# Altium schematic sheet OPAMP_TESTER.SchDoc: OPAMP_TESTER
size A4; CheckedBy: D.MOHAMMADI; DrawnBy: A.RAJABI; SheetNumber: 1; SheetTotal: 4
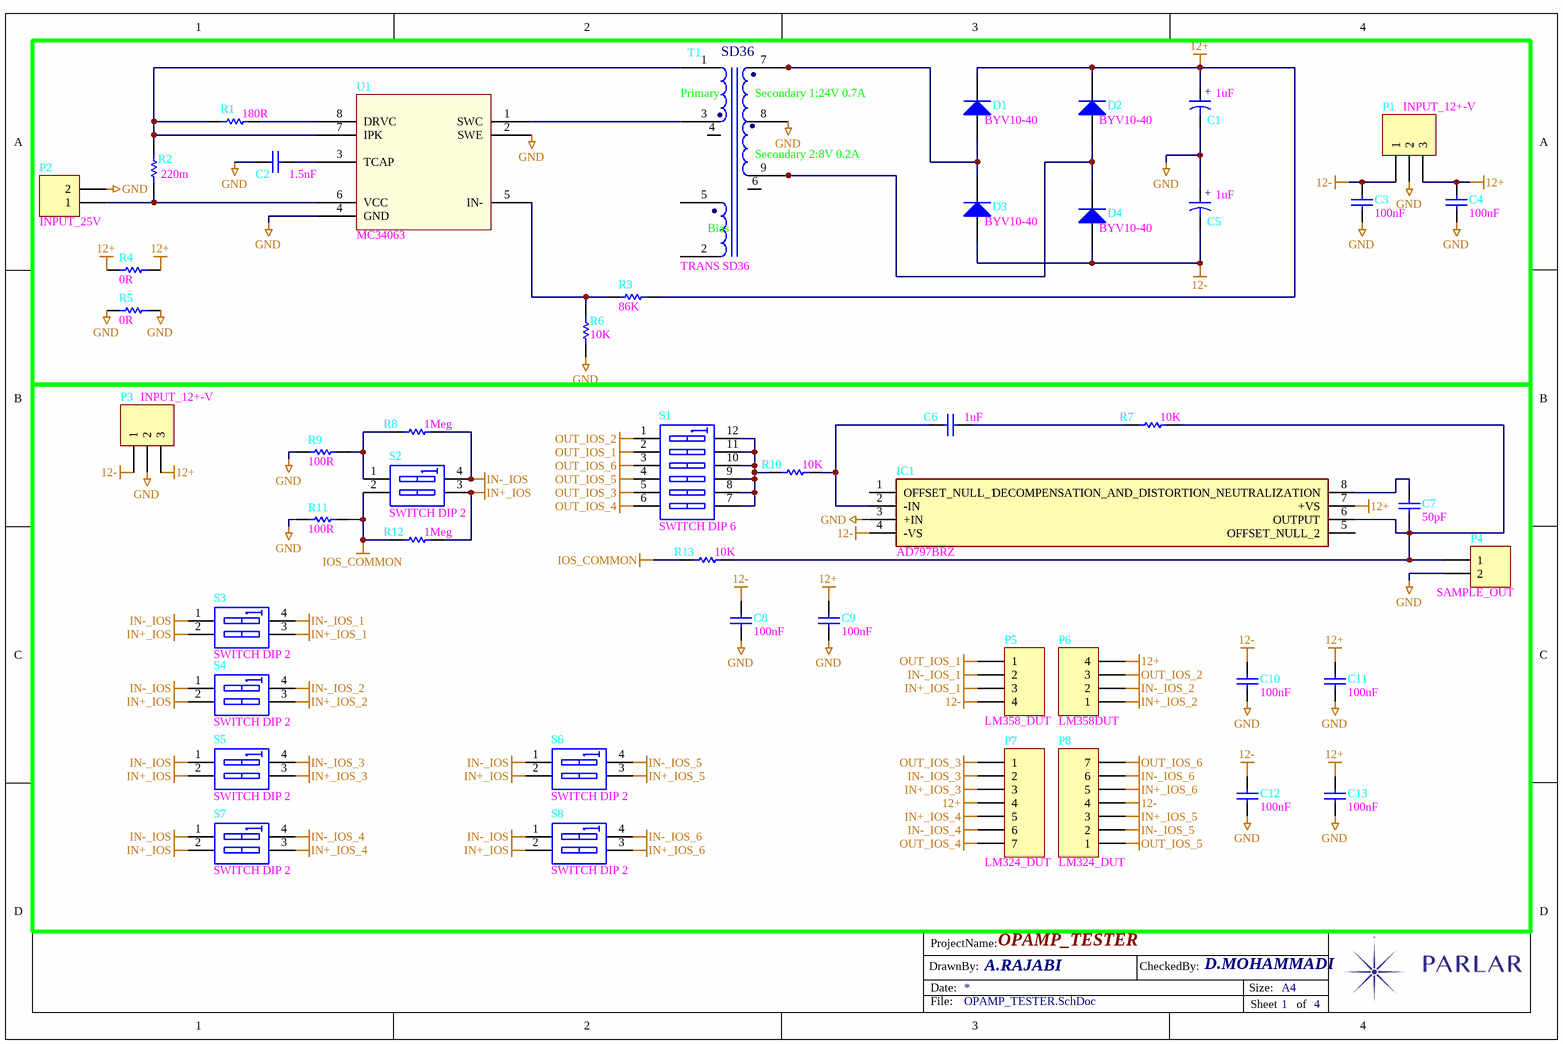
[diagram p0: OPAMP_TESTER.SchDoc]

## Parts
C1  1uF  [CAP EL D06.3 P2.5]
C2  1.5nF  [SMD 0805]
C3  100nF  [SMD 0805]
C4  100nF  [SMD 0805]
C5  1uF  [CAP EL D06.3 P2.5]
C6  1uF  [SMD 1206]
C7  50pF  [SMD 1206]
C8  100nF  [SMD 0805]
C9  100nF  [SMD 0805]
C10  100nF  [SMD 0805]
C11  100nF  [SMD 0805]
C12  100nF  [SMD 0805]
C13  100nF  [SMD 0805]
D1  BYV10-40  [SMD SMA]
D2  BYV10-40  [SMD SMA]
D3  BYV10-40  [SMD SMA]
D4  BYV10-40  [SMD SMA]
IC1  AD797BRZ  [SOIC127P600X175-8N]
P1  INPUT_12+-V  [CON XH 3]
P2  INPUT_25V  [CON XH RA 2]
P3  INPUT_12+-V  [CON XH 3]
P4  SAMPLE_OUT  [CON XH 2]
P5  LM358_DUT  [CON HDR 2.54FM 4]
P6  LM358DUT  [CON HDR 2.54FM 4]
P7  LM324_DUT  [CON HDR 2.54FM 7]
P8  LM324_DUT  [CON HDR 2.54FM 7]
R1  180R  [SMD 0805]
R2  220m  [SMD 0805]
R3  86K  [SMD 1206]
R4  0R  [SMD 1206]
R5  0R  [SMD 1206]
R6  10K  [SMD 0805]
R7  10K  [SMD 0805]
R8  1Meg  [SMD 0805]
R9  100R  [SMD 0805]
R10  10K  [SMD 1206]
R11  100R  [SMD 0805]
R12  1Meg  [SMD 0805]
R13  10K  [SMD 0805]
S1  SWITCH DIP 6  [SWITCH DIP 6]
S2  SWITCH DIP 2  [SWITCH DIP 2]
S3  SWITCH DIP 2  [SWITCH DIP 2]
S4  SWITCH DIP 2  [SWITCH DIP 2]
S5  SWITCH DIP 2  [SWITCH DIP 2]
S6  SWITCH DIP 2  [SWITCH DIP 2]
S7  SWITCH DIP 2  [SWITCH DIP 2]
S8  SWITCH DIP 2  [SWITCH DIP 2]
T1  TRANS SD36  [TR EC28/20 VER 5+5]
U1  MC34063  [SMD IC SOP8]

## Nets
12+: C1.1 C4.2 C9.2 C11.2 C13.2 D1.2 D2.2 IC1.7(+VS) P1.3 P3.3 P6.4 P7.4 R3.2 R4.1 R4.2
12-: C3.2 C5.2 C8.2 C10.2 C12.2 D3.1 D4.1 IC1.4(-VS) P1.1 P3.1 P5.4 P8.4
GND: C1.2 C2.1 C3.1 C4.1 C5.1 C8.1 C9.1 C10.1 C11.1 C12.1 C13.1 IC1.3(+IN) P1.2 P2.2 P3.2 P4.2 R5.1 R5.2 R6.2 R9.1 R11.1 T1.8 U1.2(SWE) U1.4(GND)
IN+_IOS: R12.2 S2.3(B2) S3.2(A2) S4.2(A2) S5.2(A2) S6.2(A2) S7.2(A2) S8.2(A2)
IN+_IOS_1: P5.3 S3.3(B2)
IN+_IOS_2: P6.1 S4.3(B2)
IN+_IOS_3: P7.3 S5.3(B2)
IN+_IOS_4: P7.5 S7.3(B2)
IN+_IOS_5: P8.3 S6.3(B2)
IN+_IOS_6: P8.5 S8.3(B2)
IN-_IOS: R8.2 S2.4(B1) S3.1(A1) S4.1(A1) S5.1(A1) S6.1(A1) S7.1(A1) S8.1(A1)
IN-_IOS_1: P5.2 S3.4(B1)
IN-_IOS_2: P6.2 S4.4(B1)
IN-_IOS_3: P7.2 S5.4(B1)
IN-_IOS_4: P7.6 S7.4(B1)
IN-_IOS_5: P8.2 S6.4(B1)
IN-_IOS_6: P8.6 S8.4(B1)
IOS_COMMON: R11.2 R12.1 R13.1 S2.2(A2)
OUT_IOS_1: P5.1 S1.2(A2)
OUT_IOS_2: P6.3 S1.1(A1)
OUT_IOS_3: P7.1 S1.5(A5)
OUT_IOS_4: P7.7 S1.6(A6)
OUT_IOS_5: P8.1 S1.4(A4)
OUT_IOS_6: P8.7 S1.3(A3)
NetC2_2: C2.2 U1.3(TCAP)
NetC6_1: C6.1 R7.1
NetC6_2: C6.2 IC1.2(-IN) R10.2
NetC7_1: C7.1 IC1.8(DECOMPENSATION_AND_DISTORTION_NEUTRALIZATION)
NetC7_2: C7.2 IC1.6(OUTPUT) P4.1 R7.2 R13.2
NetD1_1: D1.1 D3.2 T1.6 T1.7
NetD2_1: D2.1 D4.2 T1.9 T1.10
NetP2_1: P2.1 R2.2 U1.6(VCC)
NetR1_1: R1.1 R2.1 T1.1 U1.7(IPK)
NetR1_2: R1.2 U1.8(DRVC)
NetR3_1: R3.1 R6.1 U1.5(IN-)
NetR8_1: R8.1 R9.2 S2.1(A1)
NetR10_1: R10.1 S1.7(B6) S1.8(B5) S1.9(B4) S1.10(B3) S1.11(B2) S1.12(B1)
NetT1_3: T1.3 U1.1(SWC)

Not connected (* = marked no-connect by the designer): IC1 1(OFFSET_NULL_1) 5(OFFSET_NULL_2); T1 2 4 5

## Notes on the sheet
- DrawnBy:
- ProjectName:
- Date:
- CheckedBy:
- Size:
- A4
- File:
- Sheet
- of
- (in symbol CAP POL) +
- (in symbol TRANS SD36) SD36; .; Primary; Secondary 1:24V 0.7A; Secondary 2:8V 0.2A; Bias

## Library data of the parts
C1 C5 = CAP POL: Capacitor  Polarized; Published: 23-Sep-2002; PackageReference: CAPR5-4X5; Publisher: Altium Limited; PackageDescription: Capacitor; 2 Leads; Parameter 1: *
C2-C4 C6-C13 = CAP: Capacitor; Published: 8-Jun-2000; LatestRevisionDate: 17-Jul-2002; LatestRevisionNote: Re-released for DXP Platform.; PackageReference: RAD-0.3; Publisher: Altium Limited; PackageDescription: Radial Cap, Thru-Hole; 2 Leads; 0.3 in Pin Spacing
D1-D4 = DIODE: Typical Diode
IC1 = AD797BRZ: Integrated Circuit; Manufacturer_Name: Analog Devices; Datasheet Link: http://www.analog.com/static/imported-files/data_sheets/AD797.pdf; Height: 1.75mm; Manufacturer_Part_Number: AD797BRZ; Mouser Part Number: 584-AD797BRZ; Mouser Price/Stock: https://www.mouser.co.uk/ProductDetail/Analog-Devices/AD797BRZ?qs=%2FtpEQrCGXCwnXZ1Ropaiug%3D%3D; Arrow Part Number: AD797BRZ; Arrow Price/Stock: https://www.arrow.com/en/products/ad797brz/analog-devices?region=nac
P1 P3 = CONNECTOR 3: Header, 3-Pin; LatestRevisionDate: 17-Jul-2002; LatestRevisionNote: Re-released for DXP Platform.; Publisher: Altium Limited
P2 P4 = CONNECTOR 2: Header, 2-Pin; LatestRevisionDate: 17-Jul-2002; LatestRevisionNote: Re-released for DXP Platform.; Publisher: Altium Limited
P5 P6 = CONNECTOR 4: Header, 4-Pin; LatestRevisionDate: 17-Jul-2002; LatestRevisionNote: Re-released for DXP Platform.; Publisher: Altium Limited
P7 P8 = CONNECTOR 7: Header, 7-Pin; LatestRevisionDate: 17-Jul-2002; LatestRevisionNote: Re-released for DXP Platform.; Publisher: Altium Limited
R1-R13 = RES: Resistor
S1 = SWITCH DIP 6: DIP Switch, 6 Position, SPST; Published: 24-Mar-1999; LatestRevisionDate: 17-Jul-2002; LatestRevisionNote: Re-released for DXP Platform.; PackageReference: DIP-12/SW; Publisher: Altium Limited; PackageDescription: DIP Switch; 12 Leads
S2-S8 = SWITCH DIP 2: DIP Switch, 2 Position, SPST; Published: 24-Mar-1999; LatestRevisionDate: 17-Jul-2002; LatestRevisionNote: Re-released for DXP Platform.; PackageReference: DIP-4; Publisher: Altium Limited
T1 = TRANS SD36: Transformer
U1 = IC MC34063